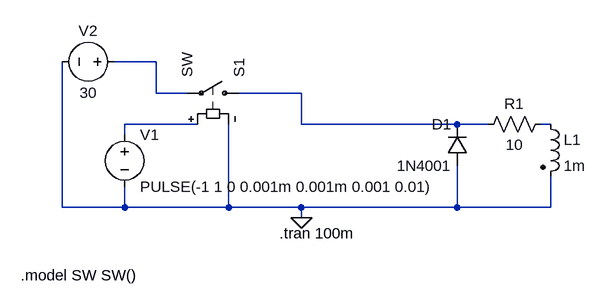
[diagram p0: schematic Draft3.asc]
Draft3.asc, the LTspice schematic file:
Version 4
SHEET 1 880 680
WIRE -368 -16 -432 -16
WIRE -368 32 -368 -16
WIRE -320 32 -368 32
WIRE -144 32 -240 32
WIRE -304 80 -416 80
WIRE -144 80 -144 32
WIRE 96 80 -144 80
WIRE 144 80 96 80
WIRE 240 80 224 80
WIRE -416 96 -416 80
WIRE -512 208 -512 -16
WIRE -416 208 -416 176
WIRE -416 208 -512 208
WIRE -256 208 -256 80
WIRE -256 208 -416 208
WIRE -144 208 -256 208
WIRE 96 208 96 144
WIRE 96 208 -144 208
WIRE 240 208 240 160
WIRE 240 208 96 208
WIRE -144 224 -144 208
FLAG -144 224 0
SYMBOL ind2 224 64 R0
SYMATTR InstName L1
SYMATTR Value 1m
SYMATTR Type ind
SYMATTR SpiceLine Ipk=50 Rser=1m
SYMBOL diode 112 144 R180
WINDOW 0 24 64 Left 2
WINDOW 3 24 0 Left 2
SYMATTR InstName D1
SYMATTR Value 1N4001
SYMBOL voltage -416 80 R0
WINDOW 123 0 0 Left 0
WINDOW 39 0 0 Left 0
SYMATTR InstName V1
SYMATTR Value PULSE(-1 1 0 0.001m 0.001m 0.001 0.01)
SYMBOL res 240 64 R90
WINDOW 0 0 56 VBottom 2
WINDOW 3 32 56 VTop 2
SYMATTR InstName R1
SYMATTR Value 10
SYMBOL sw -224 32 M270
SYMATTR InstName S1
SYMBOL voltage -416 -16 R90
WINDOW 0 -32 56 VBottom 2
WINDOW 3 32 56 VTop 2
WINDOW 123 0 0 Left 0
WINDOW 39 0 0 Left 0
SYMATTR InstName V2
SYMATTR Value 30
TEXT -178 248 Left 2 !.tran 100m
TEXT -576 312 Left 2 !.model SW SW()

The netlist it stands for:
* Draft3.asc
L1 N004 0 1m Ipk=50 Rser=1m
D1 0 N002 1N4001
V1 N003 0 PULSE(-1 1 0 0.001m 0.001m 0.001 0.01)
R1 N004 N002 10
S1 N002 N001 N003 0 SW
V2 N001 0 30
.model D D
.lib standard.dio
.tran 100m
.model SW SW()
.backanno
.end